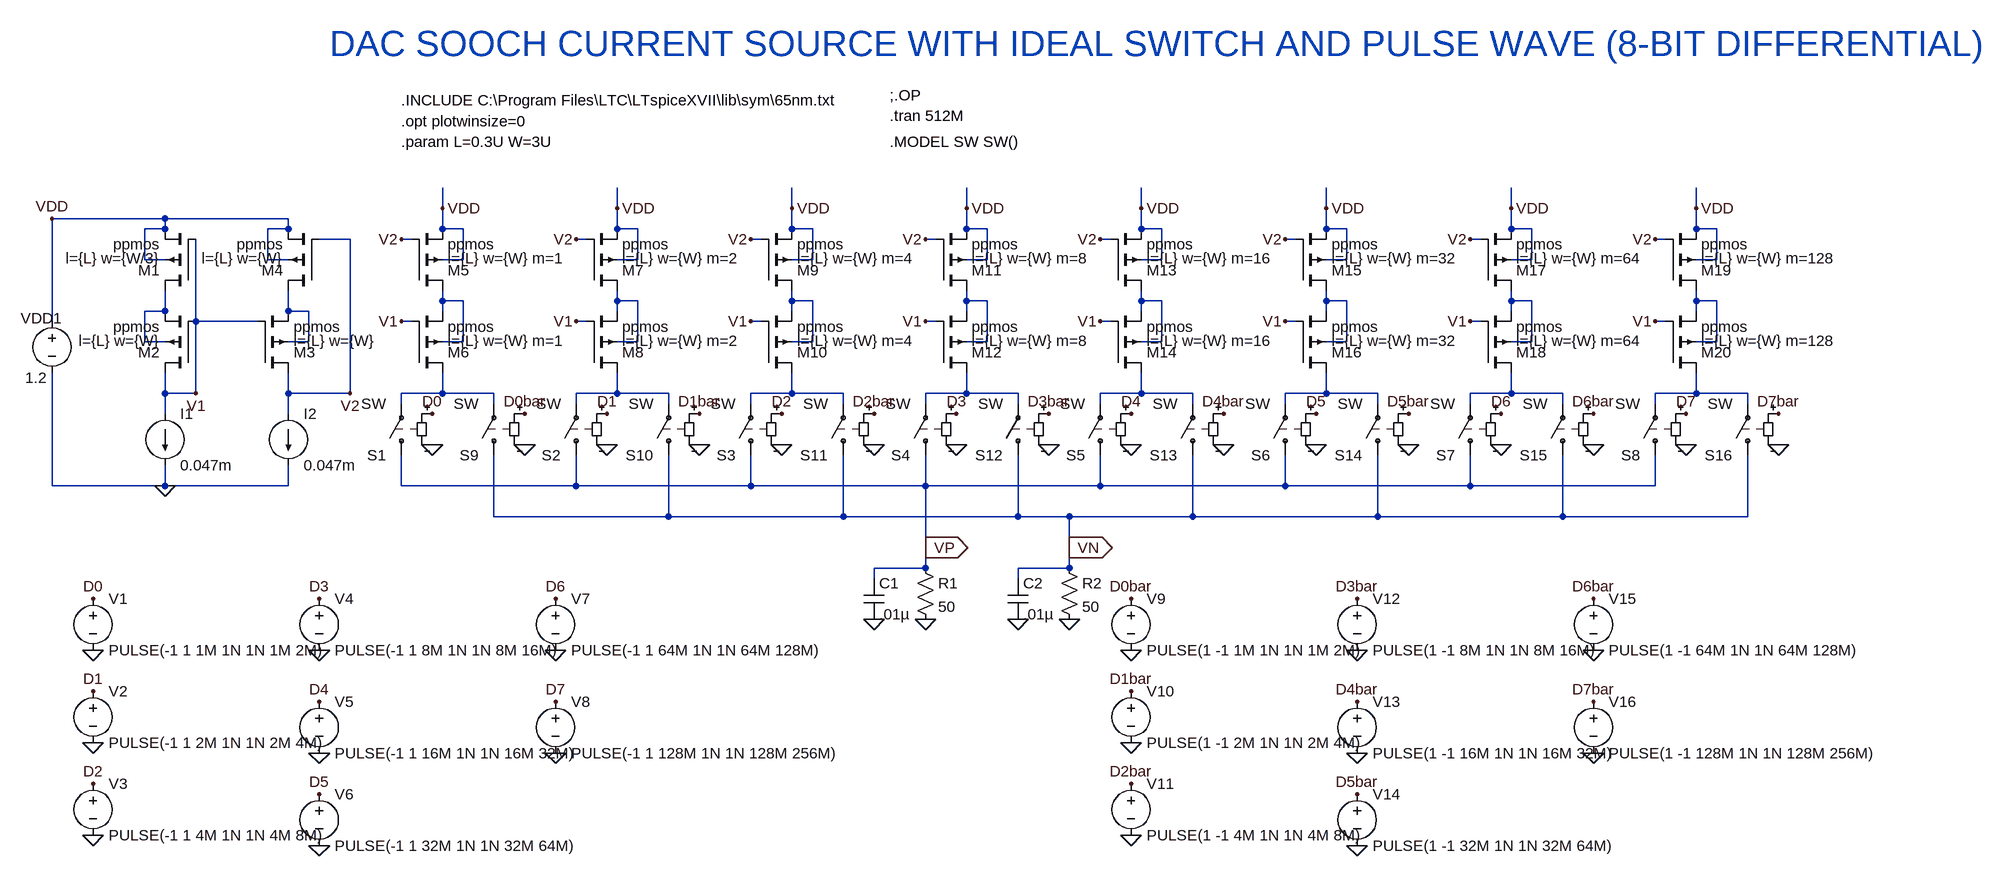
[diagram p0: schematic 104DAC_DIFF_SOOCH_PULSE.asc]
104DAC_DIFF_SOOCH_PULSE.asc, the LTspice schematic file:
Version 4
SHEET 1 1932 720
WIRE -688 -288 -688 -320
WIRE -416 -288 -416 -320
WIRE -144 -288 -144 -320
WIRE 128 -288 128 -320
WIRE 400 -288 400 -320
WIRE 688 -288 688 -320
WIRE 976 -288 976 -320
WIRE 1264 -288 1264 -320
WIRE -1120 -272 -1296 -272
WIRE -928 -272 -1120 -272
WIRE -1120 -256 -1120 -272
WIRE -1120 -256 -1152 -256
WIRE -928 -256 -928 -272
WIRE -928 -256 -960 -256
WIRE -688 -256 -688 -288
WIRE -656 -256 -688 -256
WIRE -416 -256 -416 -288
WIRE -384 -256 -416 -256
WIRE -144 -256 -144 -288
WIRE -112 -256 -144 -256
WIRE 128 -256 128 -288
WIRE 160 -256 128 -256
WIRE 400 -256 400 -288
WIRE 432 -256 400 -256
WIRE 688 -256 688 -288
WIRE 720 -256 688 -256
WIRE 976 -256 976 -288
WIRE 1008 -256 976 -256
WIRE 1264 -256 1264 -288
WIRE 1296 -256 1264 -256
WIRE -832 -240 -880 -240
WIRE -736 -240 -752 -240
WIRE -464 -240 -480 -240
WIRE -192 -240 -208 -240
WIRE 80 -240 64 -240
WIRE 352 -240 336 -240
WIRE 640 -240 624 -240
WIRE 928 -240 912 -240
WIRE 1216 -240 1200 -240
WIRE -1152 -208 -1152 -256
WIRE -1120 -208 -1152 -208
WIRE -960 -208 -960 -256
WIRE -928 -208 -960 -208
WIRE -656 -208 -656 -256
WIRE -656 -208 -688 -208
WIRE -384 -208 -384 -256
WIRE -384 -208 -416 -208
WIRE -112 -208 -112 -256
WIRE -112 -208 -144 -208
WIRE 160 -208 160 -256
WIRE 160 -208 128 -208
WIRE 432 -208 432 -256
WIRE 432 -208 400 -208
WIRE 720 -208 720 -256
WIRE 720 -208 688 -208
WIRE 1008 -208 1008 -256
WIRE 1008 -208 976 -208
WIRE 1296 -208 1296 -256
WIRE 1296 -208 1264 -208
WIRE -688 -144 -688 -160
WIRE -656 -144 -688 -144
WIRE -416 -144 -416 -160
WIRE -384 -144 -416 -144
WIRE -144 -144 -144 -160
WIRE -112 -144 -144 -144
WIRE 128 -144 128 -160
WIRE 160 -144 128 -144
WIRE 400 -144 400 -160
WIRE 432 -144 400 -144
WIRE 688 -144 688 -160
WIRE 720 -144 688 -144
WIRE 976 -144 976 -160
WIRE 1008 -144 976 -144
WIRE 1264 -144 1264 -160
WIRE 1296 -144 1264 -144
WIRE -1120 -128 -1120 -160
WIRE -1120 -128 -1152 -128
WIRE -928 -128 -928 -160
WIRE -896 -128 -928 -128
WIRE -688 -128 -688 -144
WIRE -416 -128 -416 -144
WIRE -144 -128 -144 -144
WIRE 128 -128 128 -144
WIRE 400 -128 400 -144
WIRE 688 -128 688 -144
WIRE 976 -128 976 -144
WIRE 1264 -128 1264 -144
WIRE -1296 -112 -1296 -272
WIRE -1072 -112 -1072 -240
WIRE -976 -112 -1072 -112
WIRE -736 -112 -752 -112
WIRE -464 -112 -480 -112
WIRE -192 -112 -208 -112
WIRE 80 -112 64 -112
WIRE 352 -112 336 -112
WIRE 640 -112 624 -112
WIRE 928 -112 912 -112
WIRE 1216 -112 1200 -112
WIRE -1152 -80 -1152 -128
WIRE -1120 -80 -1152 -80
WIRE -896 -80 -896 -128
WIRE -896 -80 -928 -80
WIRE -656 -80 -656 -144
WIRE -656 -80 -688 -80
WIRE -384 -80 -384 -144
WIRE -384 -80 -416 -80
WIRE -112 -80 -112 -144
WIRE -112 -80 -144 -80
WIRE 160 -80 160 -144
WIRE 160 -80 128 -80
WIRE 432 -80 432 -144
WIRE 432 -80 400 -80
WIRE 720 -80 720 -144
WIRE 720 -80 688 -80
WIRE 1008 -80 1008 -144
WIRE 1008 -80 976 -80
WIRE 1296 -80 1296 -144
WIRE 1296 -80 1264 -80
WIRE -1120 0 -1120 -32
WIRE -1072 0 -1072 -112
WIRE -1072 0 -1120 0
WIRE -928 0 -928 -32
WIRE -832 0 -832 -240
WIRE -832 0 -928 0
WIRE -688 0 -688 -32
WIRE -688 0 -752 0
WIRE -608 0 -688 0
WIRE -416 0 -416 -32
WIRE -416 0 -480 0
WIRE -336 0 -416 0
WIRE -144 0 -144 -32
WIRE -144 0 -208 0
WIRE -64 0 -144 0
WIRE 128 0 128 -32
WIRE 128 0 64 0
WIRE 208 0 128 0
WIRE 400 0 400 -32
WIRE 400 0 336 0
WIRE 480 0 400 0
WIRE 688 0 688 -32
WIRE 688 0 624 0
WIRE 768 0 688 0
WIRE 976 0 976 -32
WIRE 976 0 912 0
WIRE 1056 0 976 0
WIRE 1264 0 1264 -32
WIRE 1264 0 1200 0
WIRE 1344 0 1264 0
WIRE -752 16 -752 0
WIRE -608 16 -608 0
WIRE -480 16 -480 0
WIRE -336 16 -336 0
WIRE -208 16 -208 0
WIRE -64 16 -64 0
WIRE 64 16 64 0
WIRE 208 16 208 0
WIRE 336 16 336 0
WIRE 480 16 480 0
WIRE 624 16 624 0
WIRE 768 16 768 0
WIRE 912 16 912 0
WIRE 1056 16 1056 0
WIRE 1200 16 1200 0
WIRE 1344 16 1344 0
WIRE -1120 32 -1120 0
WIRE -928 32 -928 0
WIRE -1296 144 -1296 -32
WIRE -1120 144 -1120 112
WIRE -1120 144 -1296 144
WIRE -928 144 -928 112
WIRE -928 144 -1120 144
WIRE -752 144 -752 96
WIRE -480 144 -480 96
WIRE -480 144 -752 144
WIRE -208 144 -208 96
WIRE -208 144 -480 144
WIRE 64 144 64 96
WIRE 64 144 -208 144
WIRE 336 144 336 96
WIRE 336 144 64 144
WIRE 624 144 624 96
WIRE 624 144 336 144
WIRE 912 144 912 96
WIRE 912 144 624 144
WIRE 1200 144 1200 96
WIRE 1200 144 912 144
WIRE -608 192 -608 96
WIRE -336 192 -336 96
WIRE -336 192 -608 192
WIRE -64 192 -64 96
WIRE -64 192 -336 192
WIRE 208 192 208 96
WIRE 208 192 -64 192
WIRE 288 192 208 192
WIRE 480 192 480 96
WIRE 480 192 288 192
WIRE 768 192 768 96
WIRE 768 192 480 192
WIRE 1056 192 1056 96
WIRE 1056 192 768 192
WIRE 1344 192 1344 96
WIRE 1344 192 1056 192
WIRE 64 240 64 144
WIRE 288 240 288 192
WIRE 64 272 64 240
WIRE 64 272 -16 272
WIRE 288 272 288 240
WIRE 288 272 208 272
WIRE -16 288 -16 272
WIRE 208 288 208 272
FLAG -1072 0 V1
FLAG -752 -112 V1
FLAG -832 0 V2
FLAG -752 -240 V2
FLAG -688 -288 VDD
FLAG -1296 -272 VDD
FLAG -480 -112 V1
FLAG -480 -240 V2
FLAG -416 -288 VDD
FLAG -208 -112 V1
FLAG -208 -240 V2
FLAG -144 -288 VDD
FLAG 64 -112 V1
FLAG 64 -240 V2
FLAG 128 -288 VDD
FLAG 336 -112 V1
FLAG 336 -240 V2
FLAG 400 -288 VDD
FLAG 624 -112 V1
FLAG 624 -240 V2
FLAG 688 -288 VDD
FLAG 912 -112 V1
FLAG 912 -240 V2
FLAG 976 -288 VDD
FLAG 1200 -112 V1
FLAG 1200 -240 V2
FLAG 1264 -288 VDD
FLAG -704 80 0
FLAG -432 80 0
FLAG -160 80 0
FLAG 112 80 0
FLAG 384 80 0
FLAG 672 80 0
FLAG 960 80 0
FLAG 1248 80 0
FLAG 64 352 0
FLAG -704 32 D0
FLAG -432 32 D1
FLAG -160 32 D2
FLAG 112 32 D3
FLAG 384 32 D4
FLAG 672 32 D5
FLAG 960 32 D6
FLAG 1248 32 D7
FLAG -1120 144 0
FLAG -1232 400 0
FLAG -1232 544 0
FLAG -1232 688 0
FLAG -880 400 0
FLAG -880 560 0
FLAG -1232 320 D0
FLAG -1232 464 D1
FLAG -1232 608 D2
FLAG -880 320 D3
FLAG -880 480 D4
FLAG -880 704 0
FLAG -512 400 0
FLAG -512 560 0
FLAG -880 624 D5
FLAG -512 320 D6
FLAG -512 480 D7
FLAG -16 352 0
FLAG 384 400 0
FLAG 384 544 0
FLAG 384 688 0
FLAG 736 400 0
FLAG 736 560 0
FLAG 384 320 D0bar
FLAG 384 464 D1bar
FLAG 384 608 D2bar
FLAG 736 320 D3bar
FLAG 736 480 D4bar
FLAG 736 704 0
FLAG 1104 400 0
FLAG 1104 560 0
FLAG 736 624 D5bar
FLAG 1104 320 D6bar
FLAG 1104 480 D7bar
FLAG -560 80 0
FLAG -288 80 0
FLAG -16 80 0
FLAG 256 80 0
FLAG 528 80 0
FLAG 816 80 0
FLAG 1104 80 0
FLAG 1392 80 0
FLAG -560 32 D0bar
FLAG -288 32 D1bar
FLAG -16 32 D2bar
FLAG 256 32 D3bar
FLAG 528 32 D4bar
FLAG 816 32 D5bar
FLAG 1104 32 D6bar
FLAG 1392 32 D7bar
FLAG 288 352 0
FLAG 288 240 VN
IOPIN 288 240 Out
FLAG 208 352 0
FLAG 64 240 VP
IOPIN 64 240 Out
SYMBOL pmos4 -1072 -160 R180
WINDOW 123 56 50 Left 2
SYMATTR Value2 l={L} w={W/3}
SYMATTR InstName M1
SYMATTR Value ppmos
SYMBOL pmos4 -1072 -32 R180
WINDOW 123 56 50 Left 2
SYMATTR Value2 l={L} w={W}
SYMATTR InstName M2
SYMATTR Value ppmos
SYMBOL current -1120 32 R0
WINDOW 123 0 0 Left 0
WINDOW 39 0 0 Left 0
SYMATTR InstName I1
SYMATTR Value 0.047m
SYMBOL pmos4 -976 -32 M180
WINDOW 123 56 50 Left 2
SYMATTR Value2 l={L} w={W}
SYMATTR InstName M3
SYMATTR Value ppmos
SYMBOL pmos4 -880 -160 R180
WINDOW 123 56 50 Left 2
SYMATTR Value2 l={L} w={W}
SYMATTR InstName M4
SYMATTR Value ppmos
SYMBOL current -928 32 R0
WINDOW 123 0 0 Left 0
WINDOW 39 0 0 Left 0
SYMATTR InstName I2
SYMATTR Value 0.047m
SYMBOL pmos4 -736 -160 M180
WINDOW 123 56 50 Left 2
SYMATTR Value2 l={L} w={W} m=1
SYMATTR InstName M5
SYMATTR Value ppmos
SYMBOL pmos4 -736 -32 M180
WINDOW 123 56 50 Left 2
SYMATTR Value2 l={L} w={W} m=1
SYMATTR InstName M6
SYMATTR Value ppmos
SYMBOL voltage -1296 -128 R0
WINDOW 123 0 0 Left 0
WINDOW 39 0 0 Left 0
WINDOW 0 -49 11 Left 2
WINDOW 3 -42 104 Left 2
SYMATTR InstName VDD1
SYMATTR Value 1.2
SYMBOL pmos4 -464 -160 M180
WINDOW 123 56 50 Left 2
SYMATTR Value2 l={L} w={W} m=2
SYMATTR InstName M7
SYMATTR Value ppmos
SYMBOL pmos4 -464 -32 M180
WINDOW 123 56 50 Left 2
SYMATTR Value2 l={L} w={W} m=2
SYMATTR InstName M8
SYMATTR Value ppmos
SYMBOL pmos4 -192 -160 M180
WINDOW 123 56 50 Left 2
SYMATTR Value2 l={L} w={W} m=4
SYMATTR InstName M9
SYMATTR Value ppmos
SYMBOL pmos4 -192 -32 M180
WINDOW 123 56 50 Left 2
SYMATTR Value2 l={L} w={W} m=4
SYMATTR InstName M10
SYMATTR Value ppmos
SYMBOL pmos4 80 -160 M180
WINDOW 123 56 50 Left 2
SYMATTR Value2 l={L} w={W} m=8
SYMATTR InstName M11
SYMATTR Value ppmos
SYMBOL pmos4 80 -32 M180
WINDOW 123 56 50 Left 2
SYMATTR Value2 l={L} w={W} m=8
SYMATTR InstName M12
SYMATTR Value ppmos
SYMBOL pmos4 352 -160 M180
WINDOW 123 56 50 Left 2
SYMATTR Value2 l={L} w={W} m=16
SYMATTR InstName M13
SYMATTR Value ppmos
SYMBOL pmos4 352 -32 M180
WINDOW 123 56 50 Left 2
SYMATTR Value2 l={L} w={W} m=16
SYMATTR InstName M14
SYMATTR Value ppmos
SYMBOL pmos4 640 -160 M180
WINDOW 123 56 50 Left 2
SYMATTR Value2 l={L} w={W} m=32
SYMATTR InstName M15
SYMATTR Value ppmos
SYMBOL pmos4 640 -32 M180
WINDOW 123 56 50 Left 2
SYMATTR Value2 l={L} w={W} m=32
SYMATTR InstName M16
SYMATTR Value ppmos
SYMBOL pmos4 928 -160 M180
WINDOW 123 56 50 Left 2
SYMATTR Value2 l={L} w={W} m=64
SYMATTR InstName M17
SYMATTR Value ppmos
SYMBOL pmos4 928 -32 M180
WINDOW 123 56 50 Left 2
SYMATTR Value2 l={L} w={W} m=64
SYMATTR InstName M18
SYMATTR Value ppmos
SYMBOL pmos4 1216 -160 M180
WINDOW 123 56 50 Left 2
SYMATTR Value2 l={L} w={W} m=128
SYMATTR InstName M19
SYMATTR Value ppmos
SYMBOL pmos4 1216 -32 M180
WINDOW 123 56 50 Left 2
SYMATTR Value2 l={L} w={W} m=128
SYMATTR InstName M20
SYMATTR Value ppmos
SYMBOL res 48 256 R0
SYMATTR InstName R1
SYMATTR Value 50
SYMBOL sw -752 112 R180
SYMATTR InstName S1
SYMBOL sw -480 112 R180
SYMATTR InstName S2
SYMBOL sw -208 112 R180
SYMATTR InstName S3
SYMBOL sw 64 112 R180
SYMATTR InstName S4
SYMBOL sw 336 112 R180
SYMATTR InstName S5
SYMBOL sw 624 112 R180
SYMATTR InstName S6
SYMBOL sw 912 112 R180
SYMATTR InstName S7
SYMBOL sw 1200 112 R180
SYMATTR InstName S8
SYMBOL voltage -1232 304 R0
WINDOW 123 0 0 Left 0
WINDOW 39 0 0 Left 0
SYMATTR InstName V1
SYMATTR Value PULSE(-1 1 1M 1N 1N 1M 2M)
SYMBOL voltage -1232 448 R0
SYMATTR InstName V2
SYMATTR Value PULSE(-1 1 2M 1N 1N 2M 4M)
SYMBOL voltage -1232 592 R0
SYMATTR InstName V3
SYMATTR Value PULSE(-1 1 4M 1N 1N 4M 8M)
SYMBOL voltage -880 304 R0
SYMATTR InstName V4
SYMATTR Value PULSE(-1 1 8M 1N 1N 8M 16M)
SYMBOL voltage -880 464 R0
SYMATTR InstName V5
SYMATTR Value PULSE(-1 1 16M 1N 1N 16M 32M)
SYMBOL voltage -880 608 R0
SYMATTR InstName V6
SYMATTR Value PULSE(-1 1 32M 1N 1N 32M 64M)
SYMBOL voltage -512 304 R0
SYMATTR InstName V7
SYMATTR Value PULSE(-1 1 64M 1N 1N 64M 128M)
SYMBOL voltage -512 464 R0
SYMATTR InstName V8
SYMATTR Value PULSE(-1 1 128M 1N 1N 128M 256M)
SYMBOL cap -32 288 R0
SYMATTR InstName C1
SYMATTR Value .01µ
SYMBOL voltage 384 304 R0
WINDOW 123 0 0 Left 0
WINDOW 39 0 0 Left 0
SYMATTR InstName V9
SYMATTR Value PULSE(1 -1 1M 1N 1N 1M 2M)
SYMBOL voltage 384 448 R0
SYMATTR InstName V10
SYMATTR Value PULSE(1 -1 2M 1N 1N 2M 4M)
SYMBOL voltage 384 592 R0
SYMATTR InstName V11
SYMATTR Value PULSE(1 -1 4M 1N 1N 4M 8M)
SYMBOL voltage 736 304 R0
SYMATTR InstName V12
SYMATTR Value PULSE(1 -1 8M 1N 1N 8M 16M)
SYMBOL voltage 736 464 R0
SYMATTR InstName V13
SYMATTR Value PULSE(1 -1 16M 1N 1N 16M 32M)
SYMBOL voltage 736 608 R0
SYMATTR InstName V14
SYMATTR Value PULSE(1 -1 32M 1N 1N 32M 64M)
SYMBOL voltage 1104 304 R0
SYMATTR InstName V15
SYMATTR Value PULSE(1 -1 64M 1N 1N 64M 128M)
SYMBOL voltage 1104 464 R0
SYMATTR InstName V16
SYMATTR Value PULSE(1 -1 128M 1N 1N 128M 256M)
SYMBOL sw -608 112 R180
SYMATTR InstName S9
SYMBOL sw -336 112 R180
SYMATTR InstName S10
SYMBOL sw -64 112 R180
SYMATTR InstName S11
SYMBOL sw 208 112 R180
SYMATTR InstName S12
SYMBOL sw 480 112 R180
SYMATTR InstName S13
SYMBOL sw 768 112 R180
SYMATTR InstName S14
SYMBOL sw 1056 112 R180
SYMATTR InstName S15
SYMBOL sw 1344 112 R180
SYMATTR InstName S16
SYMBOL res 272 256 R0
SYMATTR InstName R2
SYMATTR Value 50
SYMBOL cap 192 288 R0
SYMATTR InstName C2
SYMATTR Value .01µ
TEXT -752 -456 Left 2 !.INCLUDE C:\\Program Files\\LTC\\LTspiceXVII\\lib\\sym\\65nm.txt
TEXT -752 -424 Left 2 !.opt plotwinsize=0
TEXT 8 -464 Left 2 !;.OP
TEXT -752 -392 Left 2 !.param L=0.3U W=3U
TEXT 8 -432 Left 2 !.tran 512M
TEXT 8 -392 Left 2 !.MODEL SW SW()
TEXT -864 -544 Left 5 ;DAC SOOCH CURRENT SOURCE WITH IDEAL SWITCH AND PULSE WAVE (8-BIT DIFFERENTIAL)

The netlist it stands for:
* 104DAC_DIFF_SOOCH_PULSE.asc
M1 N009 V1 VDD VDD ppmos l={L} w={W/3}
M2 V1 V1 N009 N009 ppmos l={L} w={W}
I1 V1 0 0.047m
M3 V2 V1 N010 N010 ppmos l={L} w={W}
M4 N010 V2 VDD VDD ppmos l={L} w={W}
I2 V2 0 0.047m
M5 N001 V2 VDD VDD ppmos l={L} w={W} m=1
M6 N011 V1 N001 N001 ppmos l={L} w={W} m=1
VDD1 VDD 0 1.2
M7 N002 V2 VDD VDD ppmos l={L} w={W} m=2
M8 N012 V1 N002 N002 ppmos l={L} w={W} m=2
M9 N003 V2 VDD VDD ppmos l={L} w={W} m=4
M10 N013 V1 N003 N003 ppmos l={L} w={W} m=4
M11 N004 V2 VDD VDD ppmos l={L} w={W} m=8
M12 N014 V1 N004 N004 ppmos l={L} w={W} m=8
M13 N005 V2 VDD VDD ppmos l={L} w={W} m=16
M14 N015 V1 N005 N005 ppmos l={L} w={W} m=16
M15 N006 V2 VDD VDD ppmos l={L} w={W} m=32
M16 N016 V1 N006 N006 ppmos l={L} w={W} m=32
M17 N007 V2 VDD VDD ppmos l={L} w={W} m=64
M18 N017 V1 N007 N007 ppmos l={L} w={W} m=64
M19 N008 V2 VDD VDD ppmos l={L} w={W} m=128
M20 N018 V1 N008 N008 ppmos l={L} w={W} m=128
R1 VP 0 50
S1 VP N011 D0 0 SW
S2 VP N012 D1 0 SW
S3 VP N013 D2 0 SW
S4 VP N014 D3 0 SW
S5 VP N015 D4 0 SW
S6 VP N016 D5 0 SW
S7 VP N017 D6 0 SW
S8 VP N018 D7 0 SW
V1 D0 0 PULSE(-1 1 1M 1N 1N 1M 2M)
V2 D1 0 PULSE(-1 1 2M 1N 1N 2M 4M)
V3 D2 0 PULSE(-1 1 4M 1N 1N 4M 8M)
V4 D3 0 PULSE(-1 1 8M 1N 1N 8M 16M)
V5 D4 0 PULSE(-1 1 16M 1N 1N 16M 32M)
V6 D5 0 PULSE(-1 1 32M 1N 1N 32M 64M)
V7 D6 0 PULSE(-1 1 64M 1N 1N 64M 128M)
V8 D7 0 PULSE(-1 1 128M 1N 1N 128M 256M)
C1 VP 0 .01µ
V9 D0bar 0 PULSE(1 -1 1M 1N 1N 1M 2M)
V10 D1bar 0 PULSE(1 -1 2M 1N 1N 2M 4M)
V11 D2bar 0 PULSE(1 -1 4M 1N 1N 4M 8M)
V12 D3bar 0 PULSE(1 -1 8M 1N 1N 8M 16M)
V13 D4bar 0 PULSE(1 -1 16M 1N 1N 16M 32M)
V14 D5bar 0 PULSE(1 -1 32M 1N 1N 32M 64M)
V15 D6bar 0 PULSE(1 -1 64M 1N 1N 64M 128M)
V16 D7bar 0 PULSE(1 -1 128M 1N 1N 128M 256M)
S9 VN N011 D0bar 0 SW
S10 VN N012 D1bar 0 SW
S11 VN N013 D2bar 0 SW
S12 VN N014 D3bar 0 SW
S13 VN N015 D4bar 0 SW
S14 VN N016 D5bar 0 SW
S15 VN N017 D6bar 0 SW
S16 VN N018 D7bar 0 SW
R2 VN 0 50
C2 VN 0 .01µ
.model NMOS NMOS
.model PMOS PMOS
.lib standard.mos
.INCLUDE C:\Program Files\LTC\LTspiceXVII\lib\sym\65nm.txt
.opt plotwinsize=0
;.OP
.param L=0.3U W=3U
.tran 512M
.MODEL SW SW()
* DAC SOOCH CURRENT SOURCE WITH IDEAL SWITCH AND PULSE WAVE (8-BIT DIFFERENTIAL)
.backanno
.end